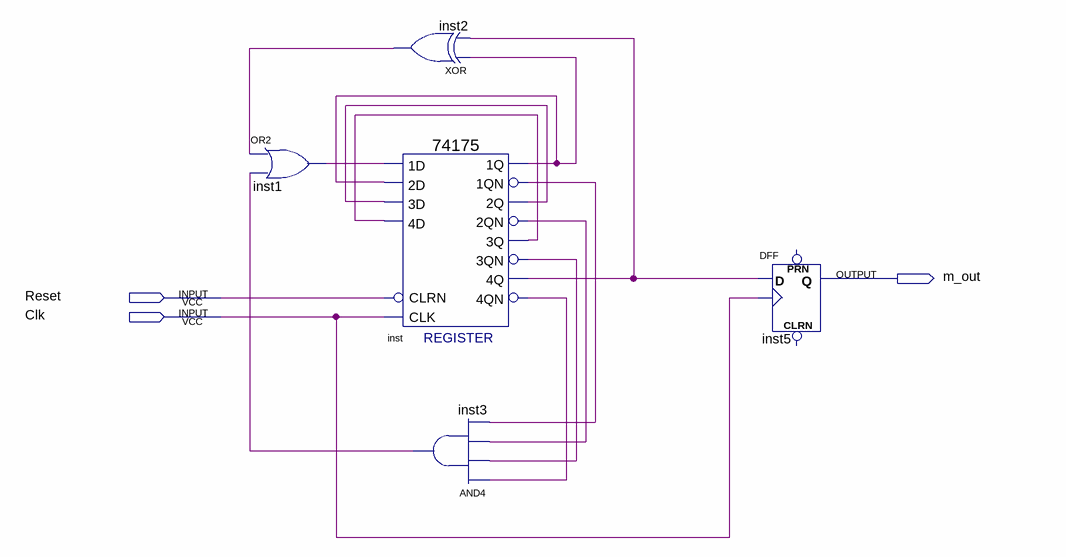
[diagram p0: schematic sheet]
// Quartus schematic mSeq.bdf as structural Verilog: 5 symbols, 3 pins
module mSeq (
  input  Reset,
  input  Clk,
  output m_out
);

  wire inst1_out, inst2_out, inst3_out, inst_1q, inst_1qn, inst_2q, inst_2qn, inst_3q, inst_3qn, inst_4q,
       inst_4qn;

  or inst1 (inst1_out, inst2_out, inst3_out);
  \74175  inst (
    .CLRN(Reset), .CLK(Clk), .\3D (inst_2q), .\2D (inst_1q), .\1D (inst1_out), .\4D (inst_3q),
    .\1QN (inst_1qn), .\1Q (inst_1q), .\2QN (inst_2qn), .\3Q (inst_3q), .\2Q (inst_2q), .\4QN (inst_4qn),
    .\4Q (inst_4q), .\3QN (inst_3qn));
  xor inst2 (inst2_out, inst_1q, inst_4q);
  and inst3 (inst3_out, inst_4qn, inst_3qn, inst_2qn, inst_1qn);
  DFF inst5 (.CLK(Clk), .D(inst_4q), .Q(m_out));  // open: CLRN, PRN
endmodule
